# Altium schematic sheet TAJ1051T.SchDoc
size A4
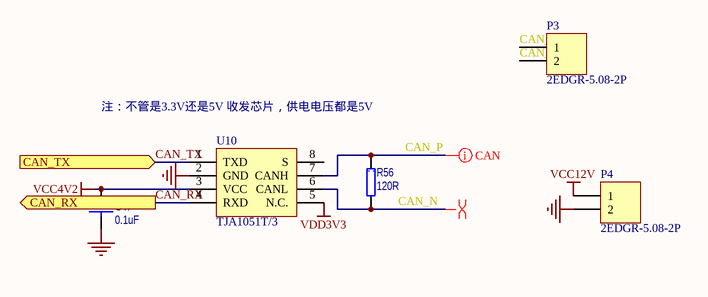
[diagram p0: TAJ1051T.SchDoc]

## Parts
C47  0.1uF  [2012[0805]06CD]
P3  2EDGR-5.08-2P  [2EDGR-5.08-2P]
P4  2EDGR-5.08-2P  [2EDGR-5.08-2P]
R56  120R  [2012[0805]R]
U10  TJA1051T/3  [SOIC8_N]

## Ports
CAN_RX (out), CAN_TX (in)

## Nets
GND: C47.2 P4.2 U10.2(GND)
VCC4V2: C47.1 U10.3(VCC)
VCC12V: P4.1
VDD3V3: U10.5(N.C.)
CAN_N: P3.2 R56.2 U10.6(CANL)
CAN_P: P3.1 R56.1 U10.7(CANH)
CAN_RX: U10.4(RXD) ; port CAN_RX
CAN_TX: U10.1(TXD) ; port CAN_TX

Not connected (* = marked no-connect by the designer): U10 8(S)

## Layout directives
differential pair: CAN_N, CAN_P

## Notes on the sheet
- (near U10) 注：不管是3.3V还是5V 收发芯片，供电电压都是5V

## Library data of the parts
C47 = CAP: Capacitor; Manufacturer: TDK; Type: 无铅电容; Model: C0603X7R1H104K; Value: 0.1uF
P3 P4 = Header 2: Header, 2-Pin; LatestRevisionDate: 17-Jul-2002; LatestRevisionNote: Re-released for DXP Platform.; Publisher: Altium Limited
R56 = RES: Manufacturer: vishay; Model: RT0603DRD7D120RL; Value: 120R; Type: 无铅电阻
U10 = TJA1051T/3: IC; 公司: NXP